# Altium project Sinalização_Official.PrjPcb
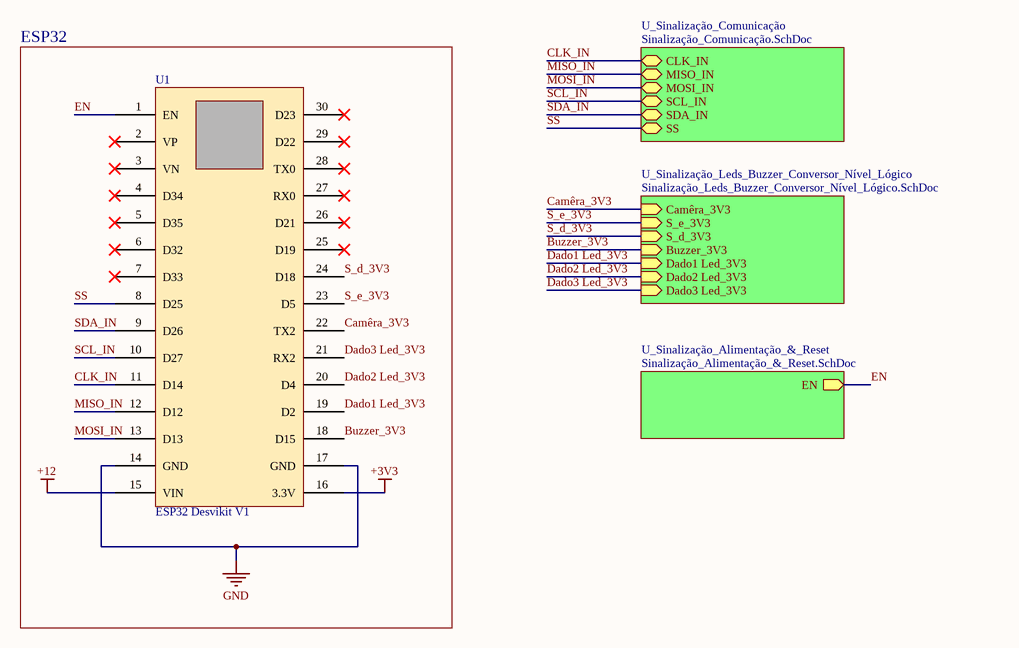
[diagram p0: Sinalização_Official.SchDoc]
4 sheets, 27 parts. Net scope: hierarchical (ports join the sheet entries above them; power ports are global).
Board file: Sinalização_Official.PcbDoc
Sheets:
  Sinalização_Official.SchDoc
    U_Sinalização_Alimentação_&_Reset = Sinalização_Alimentação_&_Reset.SchDoc
    U_Sinalização_Leds_Buzzer_Conversor_Nível_Lógico = Sinalização_Leds_Buzzer_Conversor_Nível_Lógico.SchDoc
    U_Sinalização_Comunicação = Sinalização_Comunicação.SchDoc

## Sheet Sinalização_Official.SchDoc
size A4; SheetNumber: 1; SheetTotal: 4

### Parts
U1  value ESP32 Desvikit V1  [ESP32_Desvikit_v1]  (hidden comment: microcontrolador)

### Blocks framed on the sheet
ESP32: U1

### Sub-sheets
U_Sinalização_Alimentação_&_Reset = Sinalização_Alimentação_&_Reset.SchDoc: EN (out)
U_Sinalização_Comunicação = Sinalização_Comunicação.SchDoc: CLK_IN (bidir), MISO_IN (bidir), MOSI_IN (bidir), SCL_IN (bidir), SDA_IN (bidir), SS (bidir)
U_Sinalização_Leds_Buzzer_Conversor_Nível_Lógico = Sinalização_Leds_Buzzer_Conversor_Nível_Lógico.SchDoc: Dado3 Led_3V3 (in), Dado2 Led_3V3 (in), Dado1 Led_3V3 (in), Buzzer_3V3 (in), Camêra_3V3 (in), S_e_3V3 (in), S_d_3V3 (in)

### Nets
+3V3: U1.16(3.3V)
+12: U1.15(VIN)
GND: U1.14(GND) U1.17(GND)
Buzzer_3V3: U1.18(D15) ; sheet U_Sinalização_Leds_Buzzer_Conversor_Nível_Lógico/Buzzer_3V3
Camêra_3V3: U1.22(TX2) ; sheet U_Sinalização_Leds_Buzzer_Conversor_Nível_Lógico/Camêra_3V3
CLK_IN: U1.11(D14) ; sheet U_Sinalização_Comunicação/CLK_IN
Dado1 Led_3V3: U1.19(D2) ; sheet U_Sinalização_Leds_Buzzer_Conversor_Nível_Lógico/Dado1 Led_3V3
Dado2 Led_3V3: U1.20(D4) ; sheet U_Sinalização_Leds_Buzzer_Conversor_Nível_Lógico/Dado2 Led_3V3
Dado3 Led_3V3: U1.21(RX2) ; sheet U_Sinalização_Leds_Buzzer_Conversor_Nível_Lógico/Dado3 Led_3V3
EN: U1.1(EN) ; sheet U_Sinalização_Alimentação_&_Reset/EN
MISO_IN: U1.12(D12) ; sheet U_Sinalização_Comunicação/MISO_IN
MOSI_IN: U1.13(D13) ; sheet U_Sinalização_Comunicação/MOSI_IN
S_d_3V3: U1.24(D18) ; sheet U_Sinalização_Leds_Buzzer_Conversor_Nível_Lógico/S_d_3V3
S_e_3V3: U1.23(D5) ; sheet U_Sinalização_Leds_Buzzer_Conversor_Nível_Lógico/S_e_3V3
SCL_IN: U1.10(D27) ; sheet U_Sinalização_Comunicação/SCL_IN
SDA_IN: U1.9(D26) ; sheet U_Sinalização_Comunicação/SDA_IN
SS: U1.8(D25) ; sheet U_Sinalização_Comunicação/SS

Not connected (* = marked no-connect by the designer): U1 2(VP)* 3(VN)* 4(D34)* 5(D35)* 6(D32)* 7(D33)* 25(D19)* 26(D21)* 27(RX0)* 28(TX0)* 29(D22)* 30(D23)*

### Library data of the parts
U1 = ESP32 Desvikit v1: microcontrolador com moculo bluethoth e wifi

## Sheet Sinalização_Alimentação_&_Reset.SchDoc
size A4; SheetNumber: 4; SheetTotal: 4
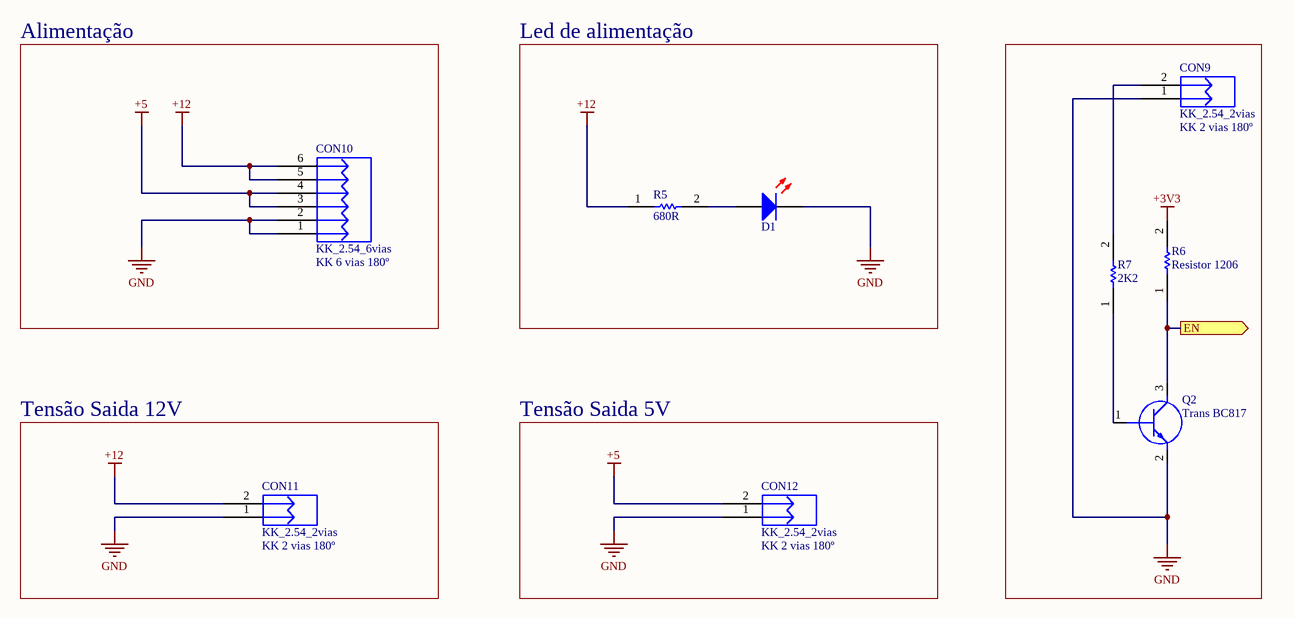
[diagram p1: Sinalização_Alimentação_&_Reset.SchDoc]

### Parts
CON9  KK_2.54_2vias  Valor: KK 2 vias 180º  [KK_2VIAS_180º]
CON10  KK_2.54_6vias  Valor: KK 6 vias 180º  [KK_6vias_180°]
CON11  KK_2.54_2vias  Valor: KK 2 vias 180º  [KK_2VIAS_180º]
CON12  KK_2.54_2vias  Valor: KK 2 vias 180º  [KK_2VIAS_180º]
D1  LED 3MM RED  [LED RED]  (value not drawn)
Q2  Trans BC817  [SOT96P240X110-3N]
R5  680R  [RESC3216X60N]
R6  Resistor 1206  [RESC3216X60N]
R7  2K2  [RESC3216X60N]

### Blocks framed on the sheet
Alimentação: CON10
Led de alimentação: D1 R5
Tensão Saida 12V: CON11
Tensão Saida 5V: CON12

### Ports
EN (out)

### Nets
+3V3: R6.2
+5: CON10.3 CON10.4 CON12.2
+12: CON10.5 CON10.6 CON11.2 R5.1
GND: CON9.1 CON10.1 CON10.2 CON11.1 CON12.1 D1.2(K) Q2.2(E)
EN: Q2.3(C) R6.1 ; port EN
NetCON9_2: CON9.2 R7.2
NetD1_1: D1.1(A) R5.2
NetQ2_1: Q2.1(B) R7.1

### Library data of the parts
CON9 CON11 CON12 = KK_2.54_2vias: Conector KK 2.54mm 2 vias; Descrição: Conector KK 3 vias com passo 2.54mm; Encapsulamento: PTH - 180º; Modelo: 2 vias - 180º; Marca: *; Observação: *
CON10 = KK_2.54_6vias: Conector KK 2.54mm 6 vias; Descrição: Conector KK 3 vias com passo 2.54mm; Encapsulamento: PTH - 180º; Modelo: 3 vias - 180º; Marca: *; Observação: *
D1 = LED 3MM RED: Manufacturer: Paralight; Manufacturer Part Number: IMP585; Wavelength Typ: 625; Forward Voltage: 2; Forward Current If: 20; Luminous Intensity: 3; LED Mounting: Through Hole; Lens Shape: Round; Viewing Angle: 60°; SVHC: No SVHC (15-Jun-2015); External Diameter: 2.9; External Length / Height: 4.6; Forward Voltage VF Max: 2.5; LED / Lamp Size: 3mm / T-1; LED Type: Standard; Lead Cross-section Depth: 0.5; Luminous Intensity @ If Min: 0.7; PIV Max: 5; Peak Forward Current: 7; Voltage Vf Typ: 2.2V<!--FANDB--><div class="features-and-benefits-container"><div class="features-and-benefits-description"><span class="features-benefits-value">The L-934LID from Kingbright is a through hole round shape high efficiency red colour LED. The device is made of gallium arsenide phosphide on gallium phosphide orange light emitting diode. This LED is widely used because of low power consumption, long life and solid state reliability.</span></div><div class="features-and-benefits-list"><ul class="features-and-benefits-list-list"><li class="features-and-benefits-list-item">Standard bulb size of T-1 (3mm)</li><li class="features-and-benefits-list-item">Reliable and rugged</li><li class="features-and-benefits-list-item">Viewing angle is 60°</li><li class="features-and-benefits-list-item">Luminous intensity of 3mcd at 2mA</li><li class="features-and-benefits-list-item">Forward voltage is 2.0V</li><li class="features-and-benefits-list-item">Forward current (If) is 20mA</li><li class="features-and-benefits-list-item">Dominant wavelength is 625nm at IF=20mA</li><li class="features-and-benefits-list-item">Peak wavelength is 627nm at IF=20; Supplier 1: Mult Comercial; RoHS: YES; Stock 1: 35260; Pricing 1: 1=0.15 (BRL); LED Colour: Red; Bulb Size: 3mm; Packaging: Each; MSL: -; Current If Luminous Intensity: 2; Dominant Wavelength: 625; Forward Current If Max: 20; Lead Cross-section Width: 0.5; Lead Spacing: 2.54; Luminous Intensity Typ: 3; Mounting Type: PCB Through Hole; No. of Pins: 2; Operating Temperature Max: 85; Operating Temperature Min: -40; Operating Temperature Range: -40°C to +85; Peak Wavelength: 625; ComponentLink1URL: http://loja.multcomercial.com.br/led-3mm-vermelho-difuso-l-314hd-paralight.html; ComponentLink1Description: http://loja.multcomercial.com.br/led-3mm-vermelho-difuso-l-314hd-paralight.html; Supplier Part Number 1: Led 3mm Vermelho Difuso L-314HD - Paralight
Q2 = Trans BC817: Transistor BJT NPN BC817-25-7-F; Manufacturer_Name: Diodes Inc.; Datasheet Link: https://www.diodes.com/assets/Datasheets/ds11107.pdf; Height: 1.1mm; Manufacturer_Part_Number: BC817-25-7-F; Mouser Part Number: 621-BC817-25-7-F; Mouser Price/Stock: https://www.mouser.co.uk/ProductDetail/Diodes-Incorporated/BC817-25-7-F?qs=rGAXPo9uwV0jK0EyLZnqOw%3D%3D; Arrow Part Number: BC817-25-7-F; Arrow Price/Stock: https://www.arrow.com/en/products/bc817-25-7-f/diodes-incorporated
R5-R7 = Resistor 1206: Resistor; Manufacturer_Name: Vishay; Manufacturer_Part_Number: CRCW12064K70FKEA; Datasheet Link: http://docs-emea.rs-online.com/webdocs/13ec/0900766b813ecc08.pdf; Height: 0.6mm; Mouser Part Number: 71-CRCW1206-4.7K-E3; Mouser Price/Stock: https://www.mouser.co.uk/ProductDetail/Vishay-Dale/CRCW12064K70FKEA?qs=1vm4qhDHCvlKJmatsKzyFQ%3D%3D; Arrow Part Number: CRCW12064K70FKEA; Arrow Price/Stock: https://www.arrow.com/en/products/crcw12064k70fkea/vishay

## Sheet Sinalização_Leds_Buzzer_Conversor_Nível_Lógico.SchDoc
size A4; SheetNumber: 3; SheetTotal: 4
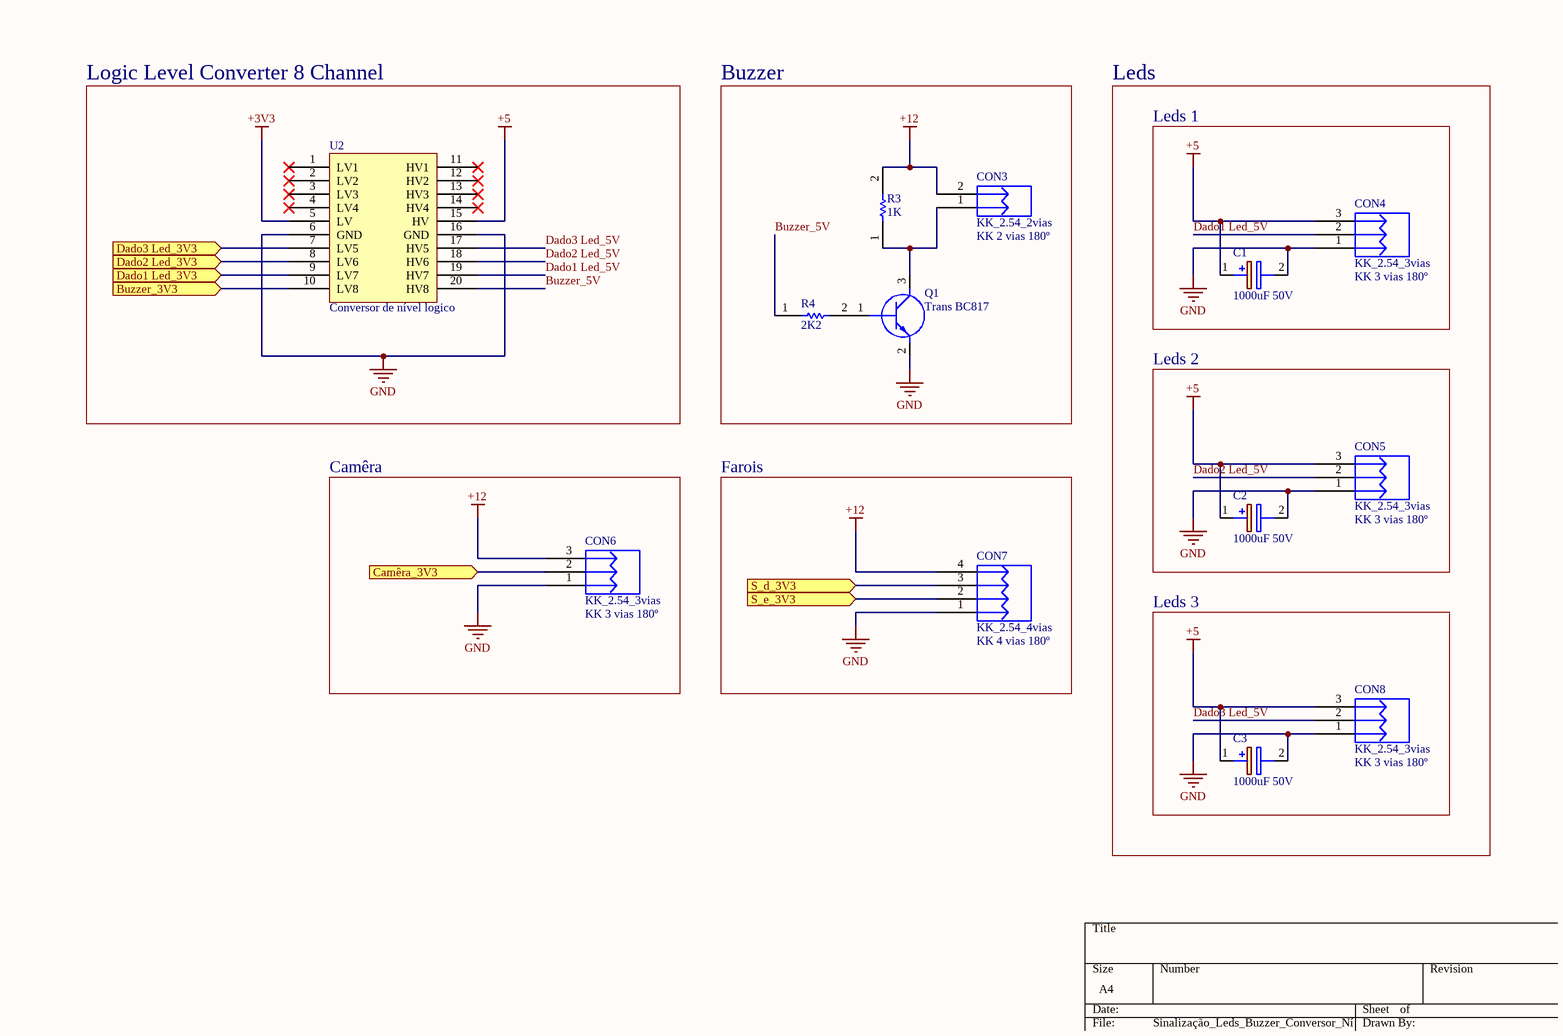
[diagram p2: Sinalização_Leds_Buzzer_Conversor_Nível_Lógico.SchDoc]

### Parts
C1  1000uF 50V  [CAPPRD500W62D1300H2650]
C2  1000uF 50V  [CAPPRD500W62D1300H2650]
C3  1000uF 50V  [CAPPRD500W62D1300H2650]
CON3  KK_2.54_2vias  Valor: KK 2 vias 180º  [KK_2VIAS_180º]
CON4  KK_2.54_3vias  Valor: KK 3 vias 180º  [KK_3vias_180º]
CON5  KK_2.54_3vias  Valor: KK 3 vias 180º  [KK_3vias_180º]
CON6  KK_2.54_3vias  Valor: KK 3 vias 180º  [KK_3vias_180º]
CON7  KK_2.54_4vias  Valor: KK 4 vias 180º  [KK_4vias_180°]
CON8  KK_2.54_3vias  Valor: KK 3 vias 180º  [KK_3vias_180º]
Q1  Trans BC817  [SOT96P240X110-3N]
R3  1K  [RESC3216X60N]
R4  2K2  [RESC3216X60N]
U2  Conversor de nível logico  [Conversor de nível lógico]

### Blocks framed on the sheet
Logic Level Converter 8 Channel: U2
Buzzer: CON3 Q1 R3 R4
Leds 1: C1 CON4
Leds 2: C2 CON5
Camêra: CON6
Farois: CON7
Leds 3: C3 CON8

### Ports
Buzzer_3V3 (in), Camêra_3V3 (in), Dado1 Led_3V3 (in), Dado2 Led_3V3 (in), Dado3 Led_3V3 (in), S_d_3V3 (in), S_e_3V3 (in)

### Nets
+3V3: U2.5(LV)
+5: C1.1(+) C2.1(+) C3.1(+) CON4.3 CON5.3 CON8.3 U2.15(HV)
+12: CON3.2 CON6.3 CON7.4 R3.2
GND: C1.2(-) C2.2(-) C3.2(-) CON4.1 CON5.1 CON6.1 CON7.1 CON8.1 Q1.2(E) U2.6(GND) U2.16(GND)
Buzzer_3V3: U2.10(LV8) ; port Buzzer_3V3
Buzzer_5V: R4.1 U2.20(HV8)
Camêra_3V3: CON6.2 ; port Camêra_3V3
Dado1 Led_3V3: U2.9(LV7) ; port Dado1 Led_3V3
Dado1 Led_5V: CON4.2 U2.19(HV7)
Dado2 Led_3V3: U2.8(LV6) ; port Dado2 Led_3V3
Dado2 Led_5V: CON5.2 U2.18(HV6)
Dado3 Led_3V3: U2.7(LV5) ; port Dado3 Led_3V3
Dado3 Led_5V: CON8.2 U2.17(HV5)
S_d_3V3: CON7.3 ; port S_d_3V3
S_e_3V3: CON7.2 ; port S_e_3V3
NetCON3_1: CON3.1 Q1.3(C) R3.1
NetQ1_1: Q1.1(B) R4.2

Not connected (* = marked no-connect by the designer): U2 1(LV1)* 2(LV2)* 3(LV3)* 4(LV4)* 11(HV1)* 12(HV2)* 13(HV3)* 14(HV4)*

### Notes on the sheet
- Leds

### Library data of the parts
C1-C3 = 1000uF 50V: Capacitor Eletrolitico 1000uF 50V; Manufacturer_Name: Wurth Elektronik; Manufacturer_Part_Number: 860010678024; Datasheet Link: https://www.mouser.com/datasheet/2/445/860010678024-1093799.pdf; Height: 26.5mm; Mouser Part Number: 710-860010678024; Mouser Price/Stock: https://www.mouser.com/Search/Refine.aspx?Keyword=710-860010678024
CON3 = KK_2.54_2vias: as CON9 on sheet Sinalização_Alimentação_&_Reset; Marca: *; Observação: *
CON4-CON6 CON8 = KK_2.54_3vias: Conector KK 2.54mm 3 vias; Descrição: Conector KK 3 vias com passo 2.54mm; Encapsulamento: PTH - 180º; Modelo: 3 vias - 180º; Marca: *; Observação: *
CON7 = KK_2.54_4vias: Conector KK 2.54mm 4 vias; Descrição: Conector KK 3 vias com passo 2.54mm; Encapsulamento: PTH - 180º; Modelo: 3 vias - 180º; Marca: *; Observação: *
Q1 = Trans BC817: as Q2 on sheet Sinalização_Alimentação_&_Reset; Datasheet Link: https://www.diodes.com/assets/Datasheets/ds11107.pdf; Height: 1.1mm; Manufacturer_Part_Number: BC817-25-7-F; Mouser Part Number: 621-BC817-25-7-F; Mouser Price/Stock: https://www.mouser.co.uk/ProductDetail/Diodes-Incorporated/BC817-25-7-F?qs=rGAXPo9uwV0jK0EyLZnqOw%3D%3D; Arrow Part Number: BC817-25-7-F; Arrow Price/Stock: https://www.arrow.com/en/products/bc817-25-7-f/diodes-incorporated
R3 R4 = Resistor 1206: as R5 on sheet Sinalização_Alimentação_&_Reset; Datasheet Link: http://docs-emea.rs-online.com/webdocs/13ec/0900766b813ecc08.pdf; Height: 0.6mm; Mouser Part Number: 71-CRCW1206-4.7K-E3; Mouser Price/Stock: https://www.mouser.co.uk/ProductDetail/Vishay-Dale/CRCW12064K70FKEA?qs=1vm4qhDHCvlKJmatsKzyFQ%3D%3D; Arrow Part Number: CRCW12064K70FKEA; Arrow Price/Stock: https://www.arrow.com/en/products/crcw12064k70fkea/vishay

## Sheet Sinalização_Comunicação.SchDoc
size A4; SheetNumber: 2; SheetTotal: 4
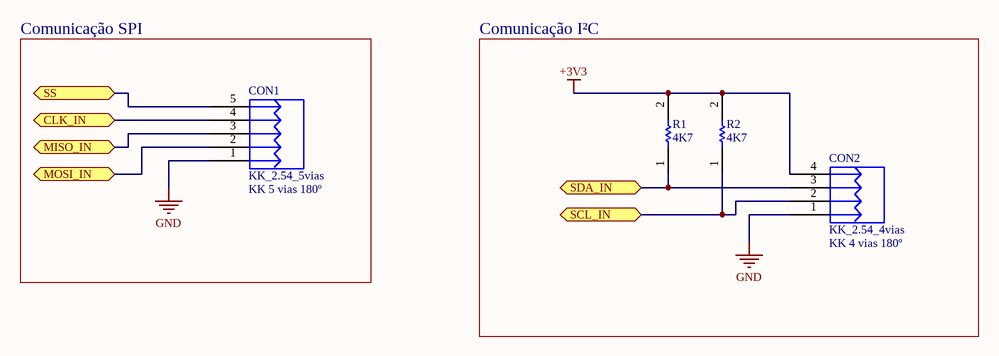
[diagram p3: Sinalização_Comunicação.SchDoc]

### Parts
CON1  KK_2.54_5vias  Valor: KK 5 vias 180º  [KK_5vias_180°]
CON2  KK_2.54_4vias  Valor: KK 4 vias 180º  [KK_4vias_180°]
R1  4K7  [RESC3216X60N]
R2  4K7  [RESC3216X60N]

### Blocks framed on the sheet
Comunicação SPI: CON1
Comunicação I²C: CON2 R1 R2

### Ports
CLK_IN (bidir), MISO_IN (bidir), MOSI_IN (bidir), SCL_IN (bidir), SDA_IN (bidir), SS (bidir)

### Nets
+3V3: CON2.4 R1.2 R2.2
GND: CON1.1 CON2.1
CLK_IN: CON1.4 ; port CLK_IN
MISO_IN: CON1.3 ; port MISO_IN
MOSI_IN: CON1.2 ; port MOSI_IN
SCL_IN: CON2.2 R2.1 ; port SCL_IN
SDA_IN: CON2.3 R1.1 ; port SDA_IN
SS: CON1.5 ; port SS

### Library data of the parts
CON1 = KK_2.54_5vias: Conector KK 2.54mm 5 vias; Descrição: Conector KK 3 vias com passo 2.54mm; Encapsulamento: PTH - 180º; Modelo: 3 vias - 180º; Marca: *; Observação: *
CON2 = KK_2.54_4vias: as CON7 on sheet Sinalização_Leds_Buzzer_Conversor_Nível_Lógico; Marca: *; Observação: *
R1 R2 = Resistor 1206: as R5 on sheet Sinalização_Alimentação_&_Reset; Datasheet Link: http://docs-emea.rs-online.com/webdocs/13ec/0900766b813ecc08.pdf; Height: 0.6mm; Mouser Part Number: 71-CRCW1206-4.7K-E3; Mouser Price/Stock: https://www.mouser.co.uk/ProductDetail/Vishay-Dale/CRCW12064K70FKEA?qs=1vm4qhDHCvlKJmatsKzyFQ%3D%3D; Arrow Part Number: CRCW12064K70FKEA; Arrow Price/Stock: https://www.arrow.com/en/products/crcw12064k70fkea/vishay

## Nets that join several sheets
+3V3: Sinalização_Official (U1.16), Sinalização_Alimentação_&_Reset (R6.2), Sinalização_Leds_Buzzer_Conversor_Nível_Lógico (U2.5), Sinalização_Comunicação (CON2.4 R1.2 R2.2)
+5: Sinalização_Alimentação_&_Reset (CON10.3 CON10.4 CON12.2), Sinalização_Leds_Buzzer_Conversor_Nível_Lógico (7 pins)
+12: Sinalização_Official (U1.15), Sinalização_Alimentação_&_Reset (CON10.5 CON10.6 CON11.2 R5.1), Sinalização_Leds_Buzzer_Conversor_Nível_Lógico (CON3.2 CON6.3 CON7.4 R3.2)
GND: Sinalização_Official (U1.14 U1.17), Sinalização_Alimentação_&_Reset (7 pins), Sinalização_Leds_Buzzer_Conversor_Nível_Lógico (11 pins), Sinalização_Comunicação (CON1.1 CON2.1)
Buzzer_3V3: Sinalização_Official (U1.18), Sinalização_Leds_Buzzer_Conversor_Nível_Lógico (U2.10)
Camêra_3V3: Sinalização_Official (U1.22), Sinalização_Leds_Buzzer_Conversor_Nível_Lógico (CON6.2)
CLK_IN: Sinalização_Official (U1.11), Sinalização_Comunicação (CON1.4)
Dado1 Led_3V3: Sinalização_Official (U1.19), Sinalização_Leds_Buzzer_Conversor_Nível_Lógico (U2.9)
Dado2 Led_3V3: Sinalização_Official (U1.20), Sinalização_Leds_Buzzer_Conversor_Nível_Lógico (U2.8)
Dado3 Led_3V3: Sinalização_Official (U1.21), Sinalização_Leds_Buzzer_Conversor_Nível_Lógico (U2.7)
EN: Sinalização_Official (U1.1), Sinalização_Alimentação_&_Reset (Q2.3 R6.1)
MISO_IN: Sinalização_Official (U1.12), Sinalização_Comunicação (CON1.3)
MOSI_IN: Sinalização_Official (U1.13), Sinalização_Comunicação (CON1.2)
S_d_3V3: Sinalização_Official (U1.24), Sinalização_Leds_Buzzer_Conversor_Nível_Lógico (CON7.3)
S_e_3V3: Sinalização_Official (U1.23), Sinalização_Leds_Buzzer_Conversor_Nível_Lógico (CON7.2)
SCL_IN: Sinalização_Official (U1.10), Sinalização_Comunicação (CON2.2 R2.1)
SDA_IN: Sinalização_Official (U1.9), Sinalização_Comunicação (CON2.3 R1.1)
SS: Sinalização_Official (U1.8), Sinalização_Comunicação (CON1.5)